# EAGLE design atmega328 (EAGLE 6.2)
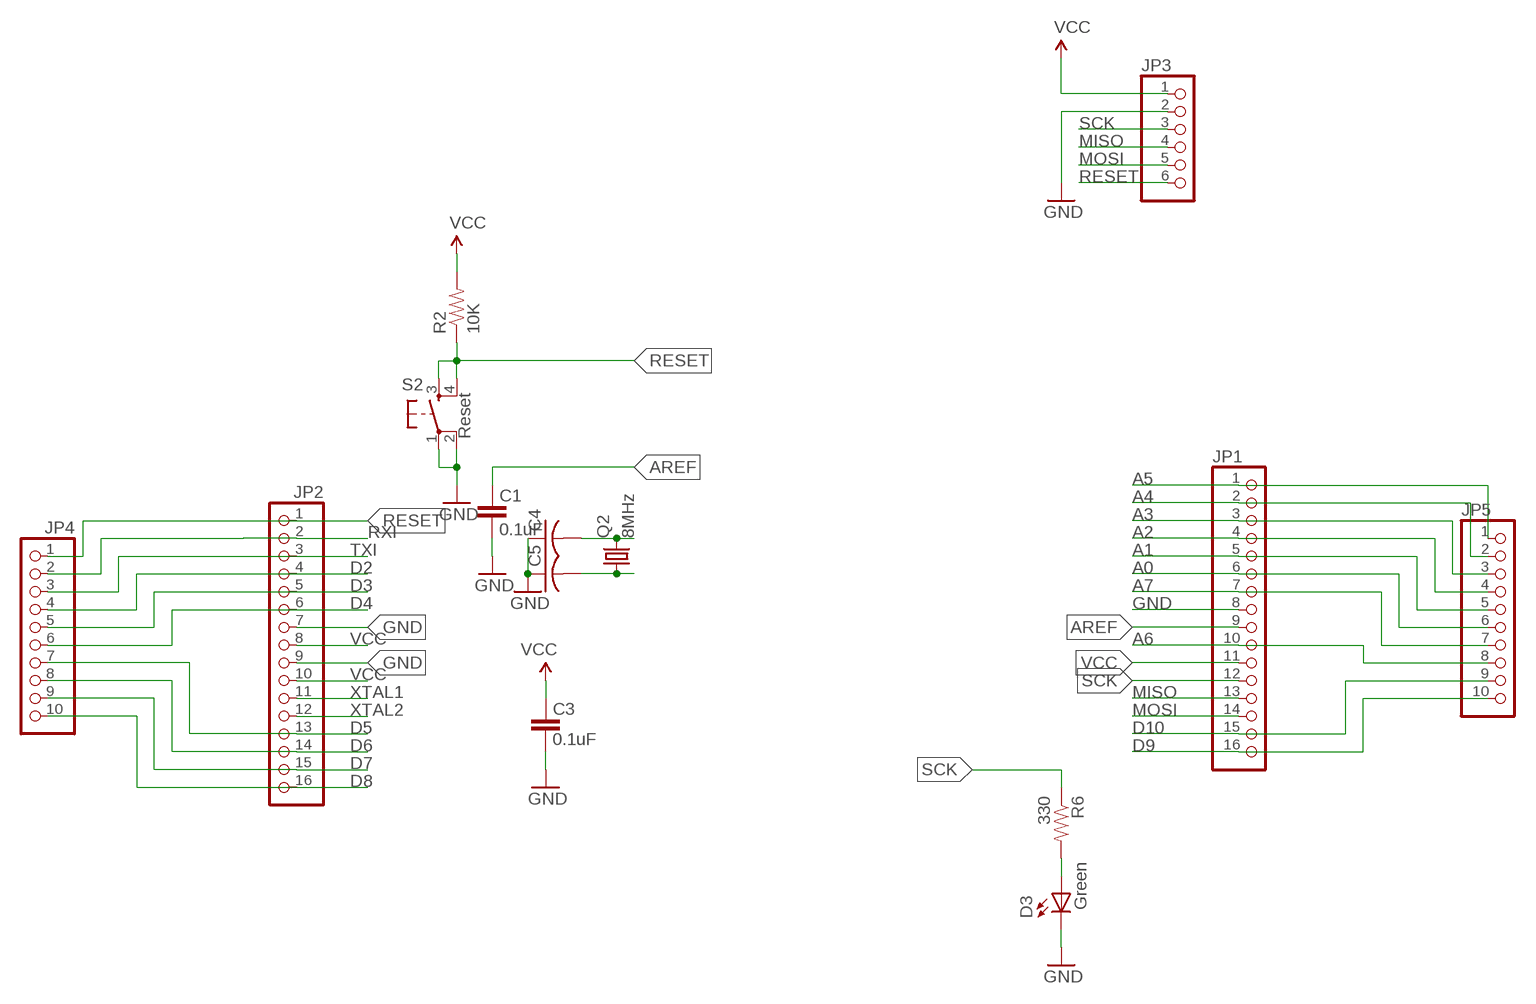
[diagram p0: schematic, sheet 1]

## Parts
C1  0.1uF  CAP0805  [0805]
C3  0.1uF  CAP0805  [0805]
C4  C-USC0805  [C0805]
C5  C-USC0805  [C0805]
D3  Green  LED0603  [LED-0603]
JP1  PINHD-1X16  [1X16]
JP2  PINHD-1X16  [1X16]
JP3  PINHD-1X6  [1X06]
JP4  PINHD-1X10  [1X10]
JP5  PINHD-1X10  [1X10]
Q2  8MHz  CRYSTALCTS406  [CTS406]
R2  10K  RESISTOR  [0805]
R6  330  RESISTOR  [0805]
S2  Reset  TAC_SWITCHSMD  [TACTILE_SWITCH_SMD]

## Nets
A0: JP1.6 JP5.6
A1: JP1.5 JP5.5
A2: JP1.4 JP5.4
A3: JP1.3 JP5.3
A4: JP1.2 JP5.2
A5: JP1.1 JP5.1
A6: JP1.10 JP5.8
A7: JP1.7 JP5.7
AREF: C1.2 JP1.9
D2: JP2.4 JP4.4
D3: JP2.5 JP4.5
D4: JP2.6 JP4.6
D5: JP2.13 JP4.7
D6: JP2.14 JP4.8
D7: JP2.15 JP4.9
D8: JP2.16 JP4.10
D9: JP1.16 JP5.10
D10: JP1.15 JP5.9
GND: C1.1 C3.1 C4.1 C5.1 D3.C JP1.8 JP2.7 JP2.9 JP3.2 S2.1 S2.2
MISO: JP1.13 JP3.4
MOSI: JP1.14 JP3.5
N$7: D3.A R6.2
RESET: JP2.1 JP3.6 JP4.1 R2.1 S2.3 S2.4
RXI: JP2.2 JP4.2
SCK: JP1.12 JP3.3 R6.1
TXI: JP2.3 JP4.3
VCC: C3.2 JP1.11 JP2.8 JP2.10 JP3.1 R2.2
XTAL1: C4.2 JP2.11 Q2.3
XTAL2: C5.2 JP2.12 Q2.1

## Library data of the parts
C1 C3 = SparkFun:CAP: Capacitor Standard 0603 ceramic capacitor, and 0.1" leaded capacitor.
C4 C5 = rcl:C-US: CAPACITOR, American symbol
D3 = SparkFun:LED: LEDs Standard schematic elements and footprints for 5mm, 3mm, 1206, and 0603 sized LEDs. 5mm - Spark Fun Electronics SKU : COM-00529 (and others)
JP1 JP2 = pinhead:PINHD-1X16: PIN HEADER
JP3 = pinhead:PINHD-1X6: PIN HEADER
JP4 JP5 = pinhead:PINHD-1X10: PIN HEADER
Q2 = crystal:CRYSTAL: CRYSTAL; OC_FARNELL: unknown; OC_NEWARK: unknown
R2 R6 = SparkFun:RESISTOR: Resistor Basic schematic elements and footprints for 0603, 1206, and PTH 1/10th watt (small) resistors.
S2 = SparkFun:TAC_SWITCH: Momentary Switch Button commonly used for reset or general input. Spark Fun Electronics SKU : COM-00097

## Net classes
3 usbvcc: width 0.203 mm, drill 0.61 mm, clearance 0.152 mm

## Board
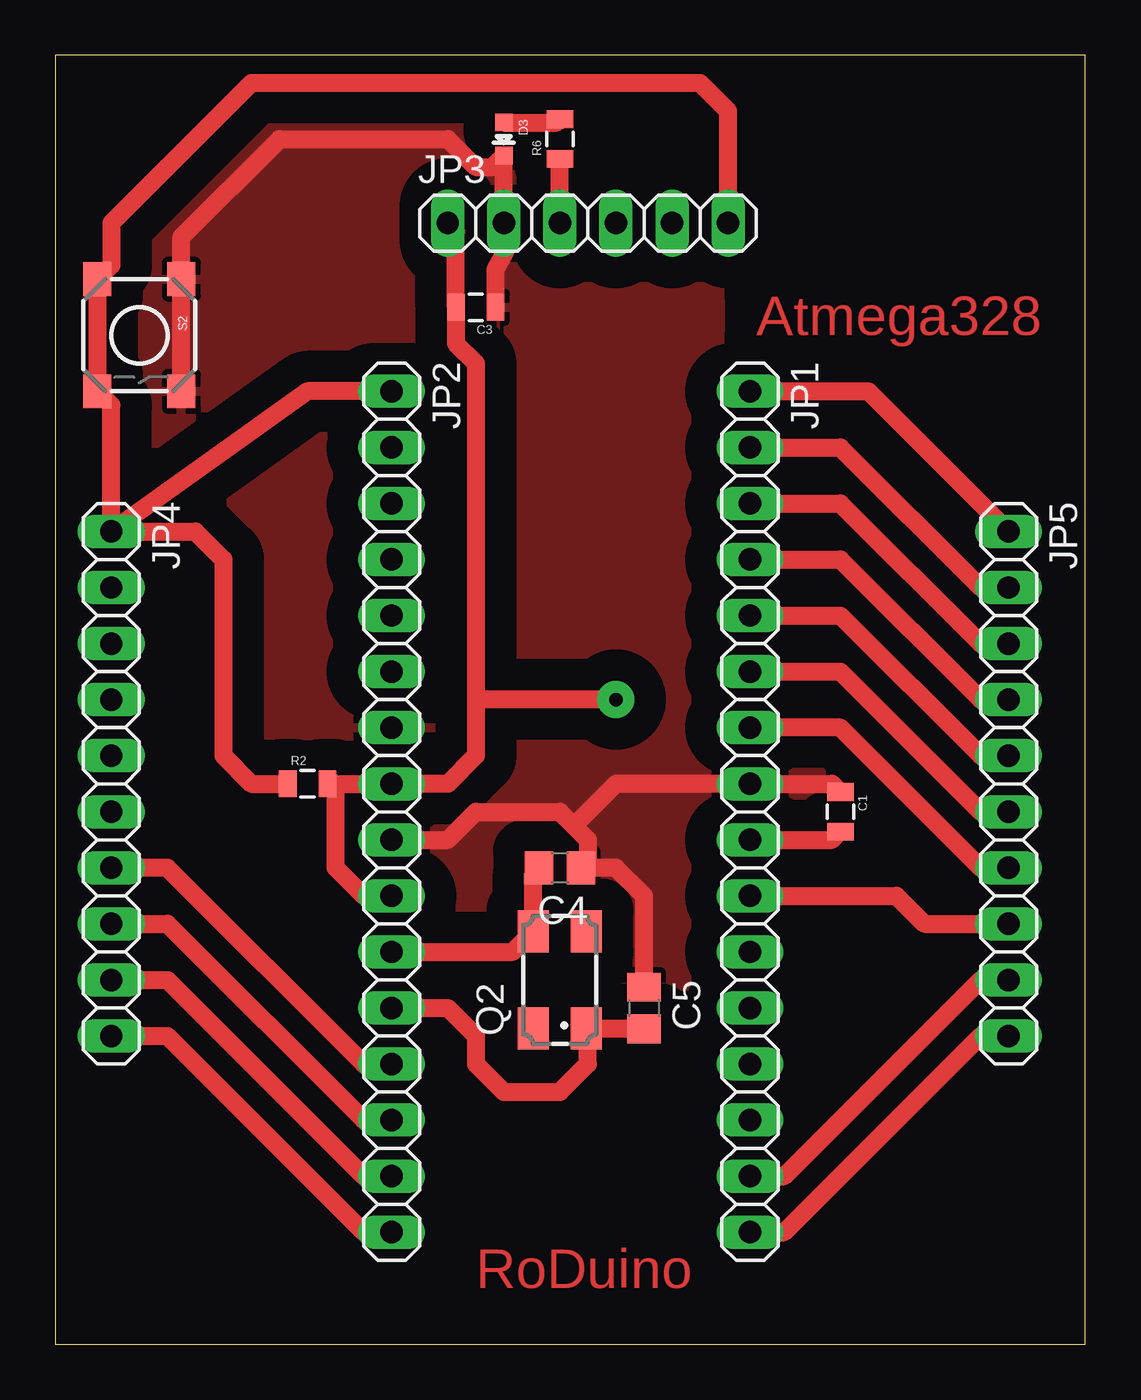
[diagram p1: board, top side]
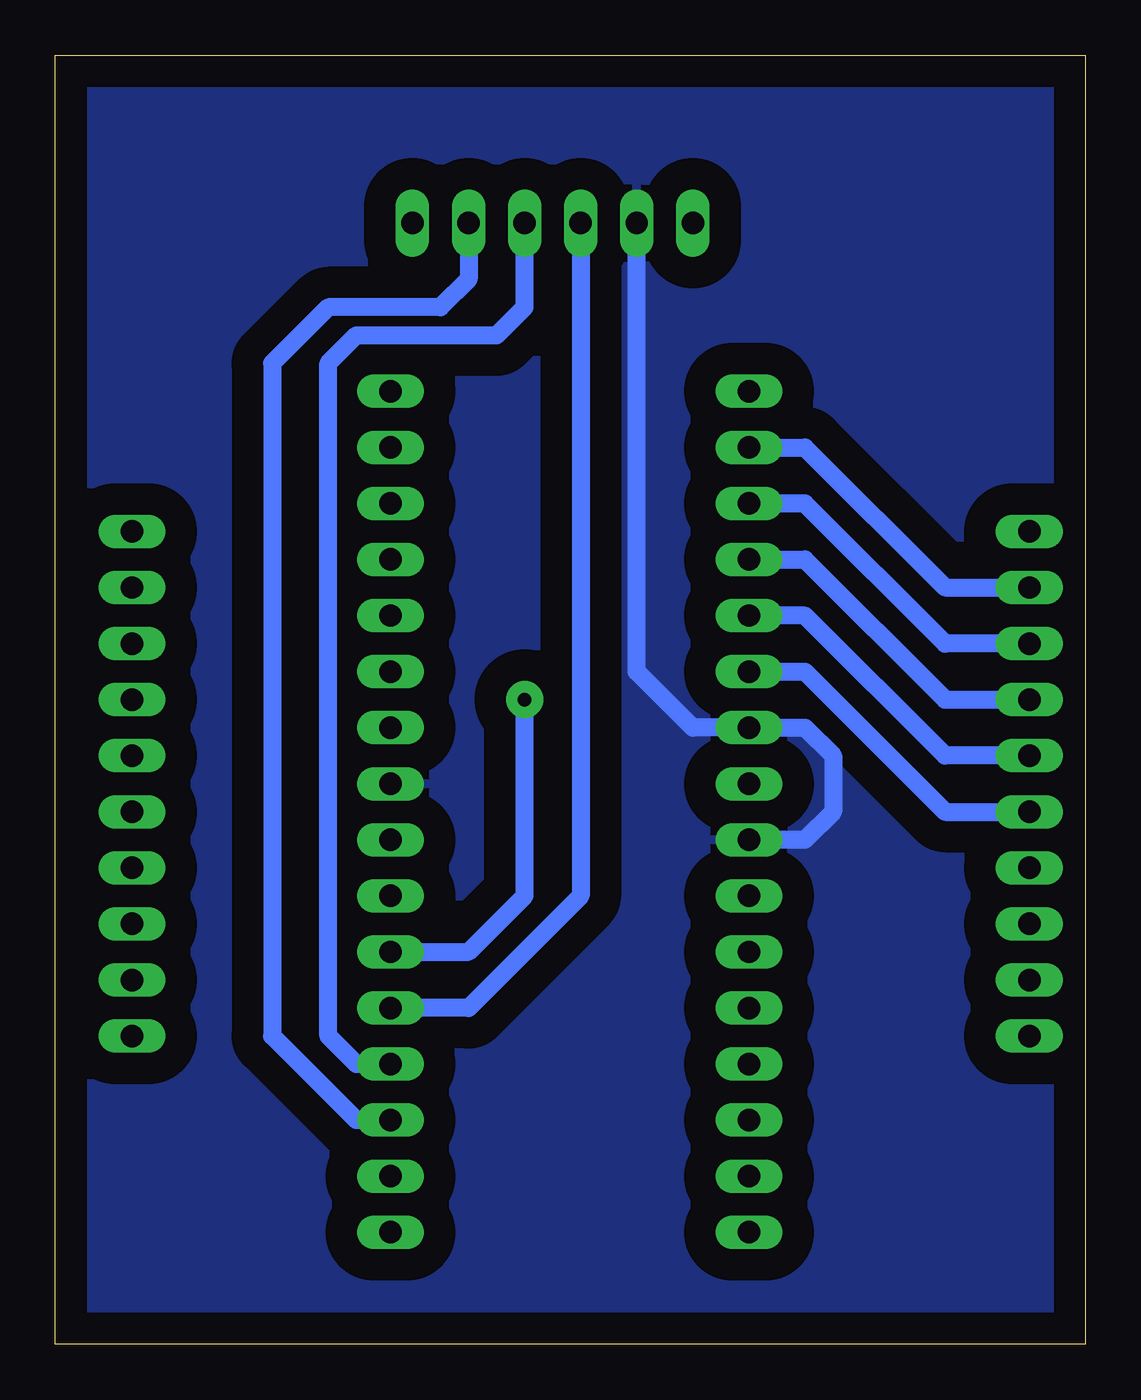
[diagram p2: board, bottom side, seen from below]

Size 46.66 x 58.41 mm. Coordinates in mm from the lower left corner, seen from the top.
Outline: 0,0 46.66,0 46.66,58.41 0,58.41 0,0
Copper layers (1*16): Top 0.035mm / dielectric 1.5mm / Bottom 0.035mm
Design rules: minimum track width 10mil, minimum drill 24mil, track to track 8mil, track to pad 8mil, pad to pad 8mil, via to via 8mil, smd to smd 8mil, copper to edge 40mil, drill to drill 8mil, minimum pad ring 10mil, minimum via ring 8mil, stop-mask expansion 4mil, vias tented up to drill 0mil, thermal gap 10mil

### Footprints (pad centres in the part's own frame; a part is rotated, then mirrored left to right if it is on the bottom)
0805 = smd 0.8 x 1.2: 1 -0.9,0; 2 0.9,0
C0805 = smd 1.3 x 1.5: 1 -0.95,0; 2 0.95,0
LED-0603 = smd 0.8 x 0.8: A 0,-0.75; C 0,0.75
1X16 = drill 1.016 long: 1 -19.05,0; 2 -16.51,0; 3 -13.97,0; 4 -11.43,0; 5 -8.89,0; 6 -6.35,0; 7 -3.81,0; 8 -1.27,0; 9 1.27,0; 10 3.81,0; 11 6.35,0; 12 8.89,0; 13 11.43,0; 14 13.97,0; 15 16.51,0; 16 19.05,0
1X06 = drill 1.016 long: 1 -6.35,0; 2 -3.81,0; 3 -1.27,0; 4 1.27,0; 5 3.81,0; 6 6.35,0
1X10 = drill 1.016 long: 1 -11.43,0; 2 -8.89,0; 3 -6.35,0; 4 -3.81,0; 5 -1.27,0; 6 1.27,0; 7 3.81,0; 8 6.35,0; 9 8.89,0; 10 11.43,0
CTS406 = smd 1.9 x 1.4: 1 -2.2,-1.2; 2 2.2,-1.2; 3 2.2,1.2; 4 -2.2,1.2
TACTILE_SWITCH_SMD = smd 1.524 x 1.27: 1 -2.54,1.905; 2 2.54,1.905; 3 -2.54,-1.905; 4 2.54,-1.905

### Placement (x,y rotation side)
C1  35.56,24.13 270 top
C3  19.05,46.99 180 top
C4  22.86,21.59 180 top
C5  26.67,15.24 270 top
D3  20.32,54.61 180 top
JP1  31.47,24.13 270 top
JP2  15.24,24.13 270 top
JP3  24.13,50.8 0 top
JP4  2.54,25.4 270 top
JP5  43.18,25.4 270 top
Q2  22.86,16.51 90 top
R2  11.43,25.4 0 top
R6  22.86,54.61 90 top
S2  3.81,45.72 270 top

### Tracks (layer width: path | path; a pad name or v marks a point on that pad's centre or on a via)
A0
  Top 0.813: JP1.6 35.56,30.48 41.91,24.13 JP5.6
A1
  Top 0.813: JP1.5 35.56,33.02 41.91,26.67 JP5.5
A2
  Top 0.813: JP1.4 35.56,35.56 41.91,29.21 JP5.4
A3
  Top 0.813: JP1.3 35.56,38.1 41.91,31.75 JP5.3
A4
  Top 0.813: JP1.2 35.56,40.64 41.91,34.29 JP5.2
A5
  Top 0.813: JP1.1 36.83,43.18 JP5.1
A6
  Top 0.813: JP1.10 38.1,20.32 39.37,19.05 JP5.8
A7
  Top 0.813: JP5.7 41.91,21.59 35.56,27.94 JP1.7
AREF
  Top 0.813: JP1.9 35.19,22.86 C1.2
D2
  Bottom 0.813: JP2.4 12.7,35.56 6.35,29.21 JP4.4
D3
  Bottom 0.813: JP4.5 6.35,26.67 12.7,33.02 JP2.5
D4
  Bottom 0.813: JP2.6 12.7,30.48 6.35,24.13 JP4.6
D5
  Top 0.813: JP2.13 13.97,12.7 5.08,21.59 JP4.7
D6
  Top 0.813: JP4.8 5.08,19.05 13.97,10.16 JP2.14
D7
  Top 0.813: JP4.9 5.08,16.51 13.97,7.62 JP2.15
D8
  Top 0.813: JP4.10 5.08,13.97 13.97,5.08 JP2.16
D9
  Top 0.813: JP1.16 33.02,5.08 41.91,13.97 JP5.10
D10
  Top 0.813: JP1.15 33.02,7.62 41.91,16.51 JP5.9
GND
  Top 0.813: S2.2 S2.1 5.71,50.16 10.16,54.61 17.78,54.61 19.05,53.34 19.8,53.34 D3.C JP3.2 20.4,50.72 20.4,49.53 19.95,48.71 C3.1 | JP2.9 17.78,22.86 19.05,24.13 22.86,24.13 23.5,23.5 | 23.5,23.5 24.13,22.86 24.13,21.91 C4.1 25.4,21.59 26.67,20.32 C5.1 | C1.1 35.19,25.4 JP1.8 25.4,25.4 23.5,23.5
  Bottom 0.813: JP2.9 12.7,22.86 11.43,24.13 11.43,26.67 12.7,27.94 JP2.7 17.78,27.94 20.32,30.48 JP3.2
  pour Bottom (isolate 1.422): 0,58.42 45.72,58.42 45.72,0 0,0
  pour Top (isolate 1.422): 0,58.42 45.72,58.42 45.72,0 0,0
MISO
  Bottom 0.813: JP1.13 33.02,12.7 34.29,13.97 34.29,44.45 33.02,45.72 26.67,45.72 25.4,46.99 JP3.4
MOSI
  Bottom 0.813: JP3.5 27.94,48.26 29.21,46.99 34.29,46.99 36.83,44.45 36.83,13.97 33.02,10.16 JP1.14
N$7
  Top 0.813: D3.A 22.71,55.36 R6.2
RESET
  Top 0.813: JP4.1 2.54,42.55 S2.4 S2.3 2.54,48.9 2.54,50.8 8.89,57.15 29.21,57.15 30.48,55.88 JP3.6 | JP2.1 11.43,43.18 JP4.1 | JP4.1 6.35,36.83 7.62,35.56 7.62,26.67 8.89,25.4 R2.1
RXI
  Bottom 0.813: JP2.2 12.7,40.64 6.35,34.29 JP4.2
SCK
  Top 0.813: JP3.3 R6.1
  Bottom 0.813: JP3.3 22.86,20.32 27.94,15.24 JP1.12
TXI
  Bottom 0.813: JP4.3 6.35,31.75 12.7,38.1 JP2.3
VCC  (via drill 0.6 pad 1.68)
  Top 0.813: JP3.1 18.15,50.43 C3.2 18.15,45.35 19.05,44.45 19.05,29.21 | 12.7,25.4 R2.2 12.7,25.4 | 12.7,25.4 JP2.8 17.78,25.4 19.05,26.67 19.05,29.21 | JP2.10 13.97,20.32 12.7,21.59 12.7,25.4 | v25.4,29.21 19.05,29.21
  Bottom 0.813: JP1.11 27.94,17.78 25.4,20.32 v25.4,29.21
XTAL1
  Top 0.813: JP2.11 20.73,17.78 Q2.3 21.66,21.34 C4.2
XTAL2
  Top 0.813: C5.2 26.65,14.31 Q2.1 24.13,14.24 24.13,12.7 22.86,11.43 20.32,11.43 19.05,12.7 19.05,13.97 17.78,15.24 JP2.12

### Text on the board
Top: Atmega328 | RoDuino